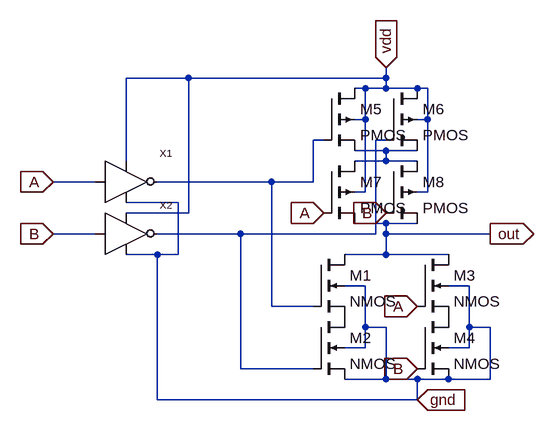
[diagram p0: schematic xor.asc]
xor.asc, the LTspice schematic file:
Version 4.1
SHEET 1 880 680
WIRE 32 -208 -64 -208
WIRE 336 -208 336 -224
WIRE 336 -208 32 -208
WIRE 304 -192 288 -192
WIRE 336 -192 336 -208
WIRE 336 -192 304 -192
WIRE 384 -192 336 -192
WIRE 400 -192 384 -192
WIRE 304 -144 304 -192
WIRE 304 -144 288 -144
WIRE 400 -144 400 -192
WIRE 400 -144 384 -144
WIRE 240 -112 224 -112
WIRE 336 -112 320 -112
WIRE 336 -96 288 -96
WIRE 384 -96 336 -96
WIRE -64 -80 -64 -208
WIRE 336 -80 336 -96
WIRE 336 -80 288 -80
WIRE 384 -80 336 -80
WIRE -112 -48 -176 -48
WIRE 160 -48 -16 -48
WIRE 224 -48 224 -112
WIRE 224 -48 160 -48
WIRE 304 -32 304 -144
WIRE 304 -32 288 -32
WIRE 400 -32 400 -144
WIRE 400 -32 384 -32
WIRE 16 -16 -64 -16
WIRE 32 0 32 -208
WIRE 32 0 -64 0
WIRE 336 16 288 16
WIRE 384 16 336 16
WIRE -112 32 -176 32
WIRE 112 32 -16 32
WIRE 320 32 320 -112
WIRE 320 32 112 32
WIRE 336 32 336 16
WIRE 496 32 336 32
WIRE -16 64 -64 64
WIRE 16 64 16 -16
WIRE 16 64 -16 64
WIRE 336 64 336 32
WIRE 336 64 272 64
WIRE 432 64 336 64
WIRE 304 112 272 112
WIRE 464 112 432 112
WIRE 160 144 160 -48
WIRE 224 144 160 144
WIRE 304 176 304 112
WIRE 336 176 304 176
WIRE 464 176 464 112
WIRE 496 176 464 176
WIRE 304 208 304 176
WIRE 304 208 272 208
WIRE 464 208 464 176
WIRE 464 208 432 208
WIRE 112 240 112 32
WIRE 224 240 112 240
WIRE 336 256 336 176
WIRE 336 256 272 256
WIRE 384 256 336 256
WIRE 432 256 384 256
WIRE 496 256 496 176
WIRE 496 256 432 256
WIRE -16 288 -16 64
WIRE 384 288 384 256
WIRE 384 288 -16 288
FLAG 384 288 gnd
IOPIN 384 288 In
FLAG 496 32 out
IOPIN 496 32 Out
FLAG 336 -224 vdd
IOPIN 336 -224 In
FLAG -176 -48 A
IOPIN -176 -48 In
FLAG -176 32 B
IOPIN -176 32 In
FLAG 240 0 A
IOPIN 240 0 In
FLAG 384 144 A
IOPIN 384 144 In
FLAG 384 240 B
IOPIN 384 240 In
FLAG 336 0 B
IOPIN 336 0 In
SYMBOL nmos4 224 64 R0
SYMATTR InstName M1
SYMBOL nmos4 224 160 R0
SYMATTR InstName M2
SYMBOL nmos4 384 64 R0
SYMATTR InstName M3
SYMBOL nmos4 384 160 R0
SYMATTR InstName M4
SYMBOL pmos4 240 -192 R0
SYMATTR InstName M5
SYMBOL pmos4 336 -192 R0
SYMATTR InstName M6
SYMBOL pmos4 240 -80 R0
SYMATTR InstName M7
SYMBOL pmos4 336 -80 R0
SYMATTR InstName M8
SYMBOL inv -64 -48 R0
SYMATTR InstName X1
SYMBOL inv -64 32 R0
SYMATTR InstName X2

The netlist it stands for:
* xor.asc
M1 out N001 P001 gnd NMOS
M2 P001 N002 gnd gnd NMOS
M3 out A P002 gnd NMOS
M4 P002 B gnd gnd NMOS
M5 vdd N001 N003 vdd PMOS
M6 vdd N002 N003 vdd PMOS
M7 N003 A out vdd PMOS
M8 N003 B out vdd PMOS
X§X1 N001 A vdd gnd inv  ; pins out in vdd gnd
X§X2 N002 B vdd gnd inv  ; pins out in vdd gnd
.model NMOS NMOS
.model PMOS PMOS
.lib standard.mos
.backanno
.end